# EAGLE design ethernet (EAGLE 4.16)
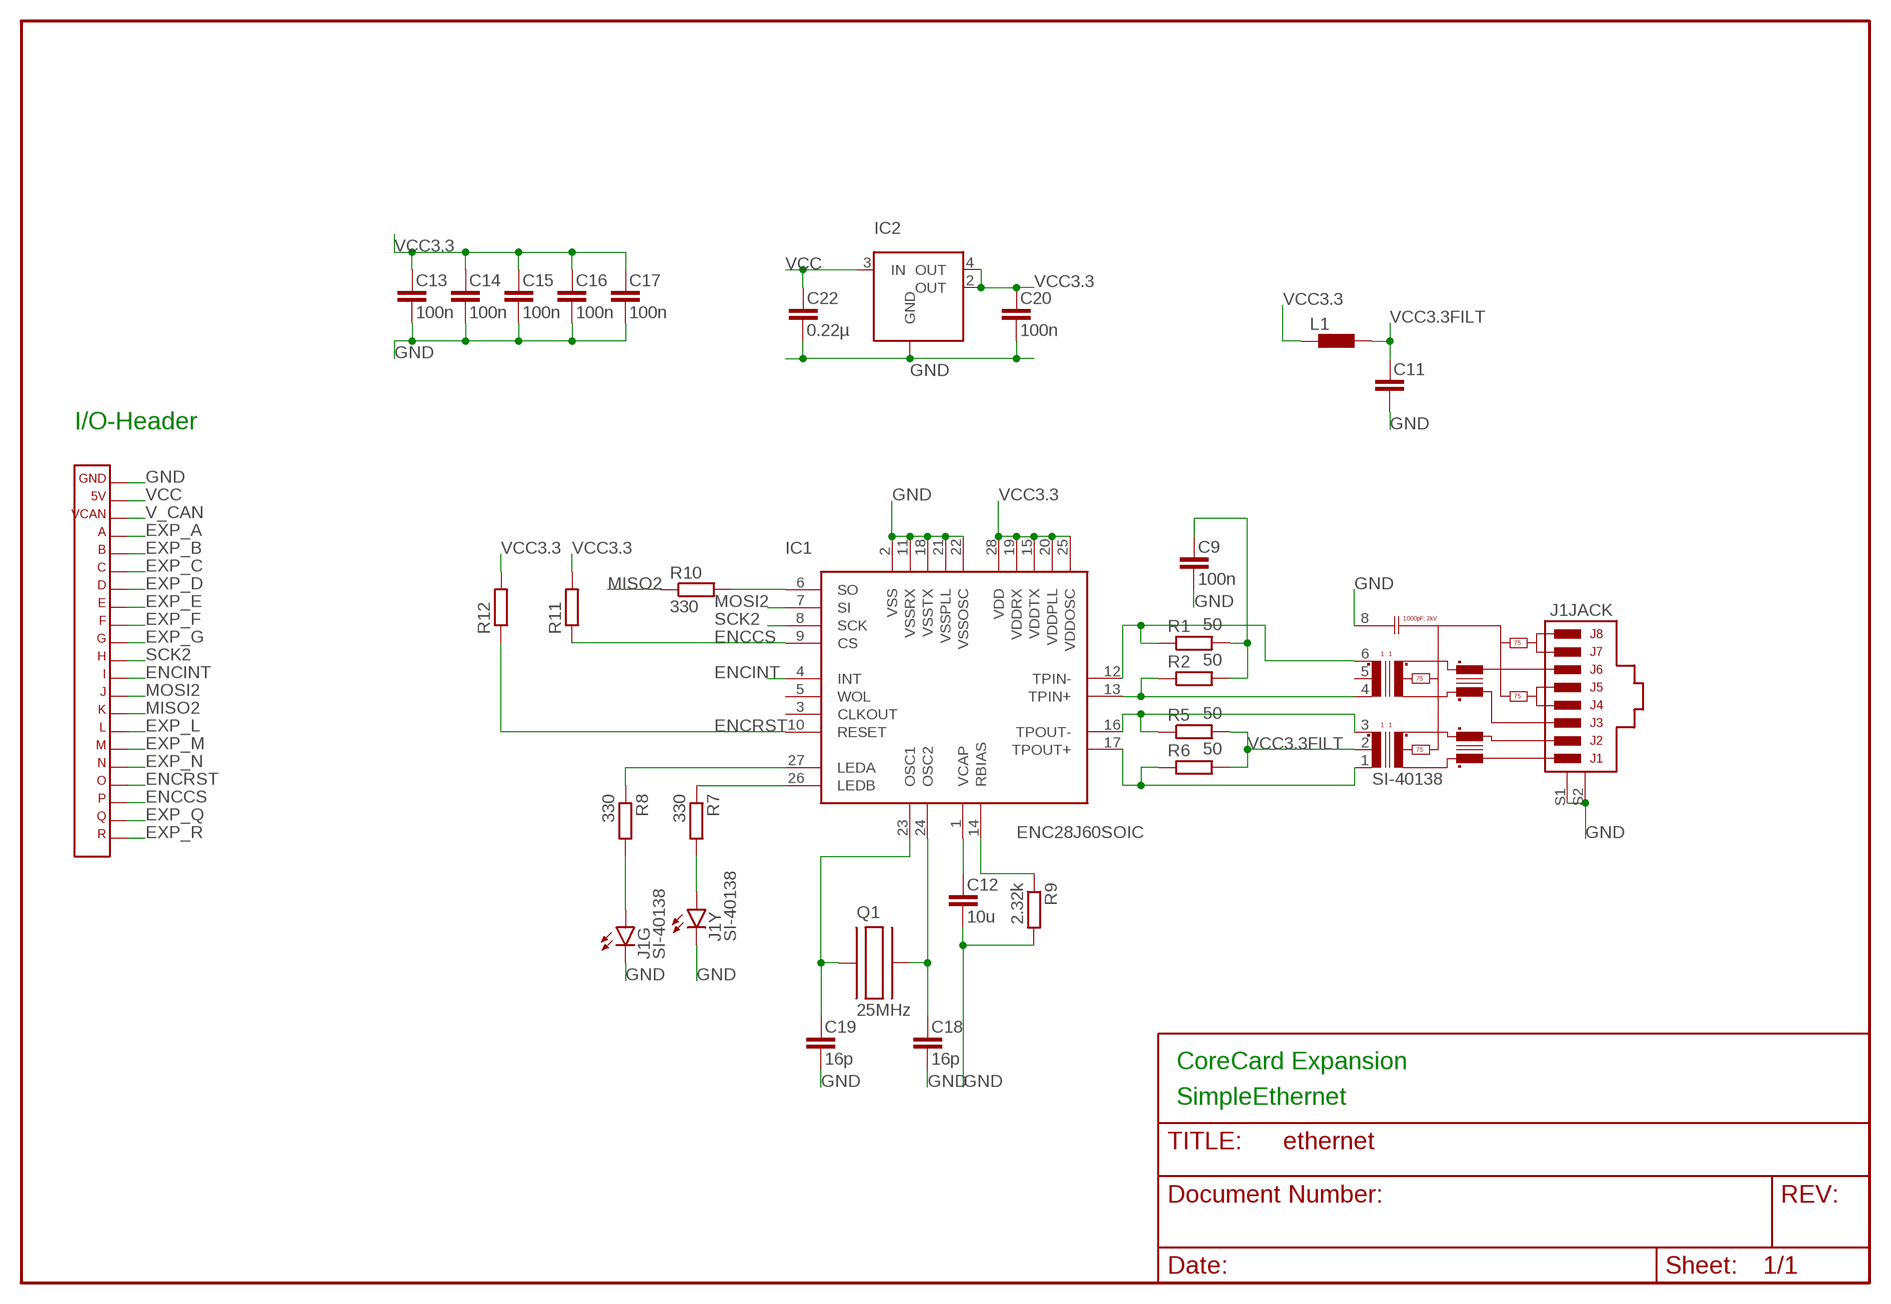
[diagram p0: schematic, sheet 1]

## Parts
C9  100n  C-EUC0603  [C0603]
C11  C-EUC0603  [C0603]
C12  10u  C-EUC0603  [C0603]
C13  100n  C-EUC0603  [C0603]
C14  100n  C-EUC0603  [C0603]
C15  100n  C-EUC0603  [C0603]
C16  100n  C-EUC0603  [C0603]
C17  100n  C-EUC0603  [C0603]
C18  16p  C-EUC0603  [C0603]
C19  16p  C-EUC0603  [C0603]
C20  100n  C-EUC0603  [C0603]
C22  0.22µ  C-EUC0603  [C0603]
IC1  ENC28J60SOIC  [SOIC-28]
IC2  LM1117MP-3.3  [SOT223]
J1  SI-40138  [SI-40138]
L1  L-EUL0603  [L0603]
Q1  25MHz  C-MAC-LFA147E  [SMD]
R1  50  R-EUR0603  [R0603]
R2  50  R-EUR0603  [R0603]
R5  50  R-EUR0603  [R0603]
R6  50  R-EUR0603  [R0603]
R7  330  R-EUR0603  [R0603]
R8  330  R-EUR0603  [R0603]
R9  2.32k  R-EUR0603  [R0603]
R10  330  R-EUR0603  [R0603]
R11  R-EUR0603  [R0603]
R12  R-EUR0603  [R0603]
X3  CORE_IOHEADEXP  [CORE_IOHEAD_NOSILC]

## Nets
ENCCS: IC1.9(CS) R11.1 X3.19
ENCINT: IC1.4(INT) X3.12
ENCRST: IC1.10(RESET) R12.1 X3.18
EXP_A: X3.4
EXP_B: X3.5
EXP_C: X3.6
EXP_D: X3.7
EXP_E: X3.8
EXP_F: X3.9
EXP_G: X3.10
EXP_L: X3.15
EXP_M: X3.16
EXP_N: X3.17
EXP_Q: X3.20
EXP_R: X3.21
GND: C9.2 C11.2 C12.2 C13.2 C14.2 C15.2 C16.2 C18.2 C19.2 C20.2 C22.2 IC1.2(VSS) IC1.11(VSSRX) IC1.18(VSSTX) IC1.21(VSSPLL) IC1.22(VSSOSC) IC2.1(GND) J1.8(JACK:GND) J1.GC(G:C) J1.S1(JACK:S1) J1.S2(JACK:S2) J1.YC(Y:C) R9.2 X3.1
MISO2: R10.1 X3.14
MOSI2: IC1.7(SI) X3.13
N$1: C18.1 IC1.24(OSC2) Q1.P$2
N$2: C19.1 IC1.23(OSC1) Q1.P$1
N$3: IC1.6(SO) R10.2
N$4: C12.1 IC1.1(VCAP)
N$5: IC1.14(RBIAS) R9.1
N$6: IC1.27(LEDA) R8.1
N$7: IC1.26(LEDB) R7.1
N$9: J1.YA(Y:A) R7.2
N$10: J1.GA(G:A) R8.2
N$13: IC1.13(TPIN+) J1.4(JACK:TD-) R2.1
N$14: IC1.16(TPOUT-) J1.3(JACK:RD+) R5.1
N$16: IC1.17(TPOUT+) J1.1(JACK:RD-) R6.1
N$17: C9.1 R1.2 R2.2
N$18: IC1.12(TPIN-) J1.6(JACK:TD+) R1.1
SCK2: IC1.8(SCK) X3.11
V_CAN: X3.3
VCC: C22.1 IC2.3(IN) X3.2
VCC3.3: C13.1 C14.1 C15.1 C16.1 C17.1 C20.1 IC1.15(VDDTX) IC1.19(VDDRX) IC1.20(VDDPLL) IC1.25(VDDOSC) IC1.28(VDD) IC2.2(OUT) IC2.4(OUT) L1.1 R11.2 R12.2
VCC3.3FILT: C11.1 J1.2(JACK:CTR) L1.2 R5.2 R6.2
Unconnected: C17.2 IC1.3(CLKOUT) IC1.5(WOL) J1.5(JACK:CTT)

## Notes on the sheet
- I/O-Header
- CoreCard Expansion
- SimpleEthernet

## Library data of the parts
C9 C11-C20 C22 = rcl:C-EU
IC1 = enc28j60:ENC28J60
IC2 = lm1117mp:LM1117MP-3.3
J1 = stewart_magjack:SI-40138
L1 = rcl:L-EU
Q1 = hc49-4h-smx:C-MAC-LFA147E
R1 R2 R5-R12 = rcl:R-EU
X3 = expboard:CORE_IOHEAD: CoreCard IO-header for expansion cards

## Board
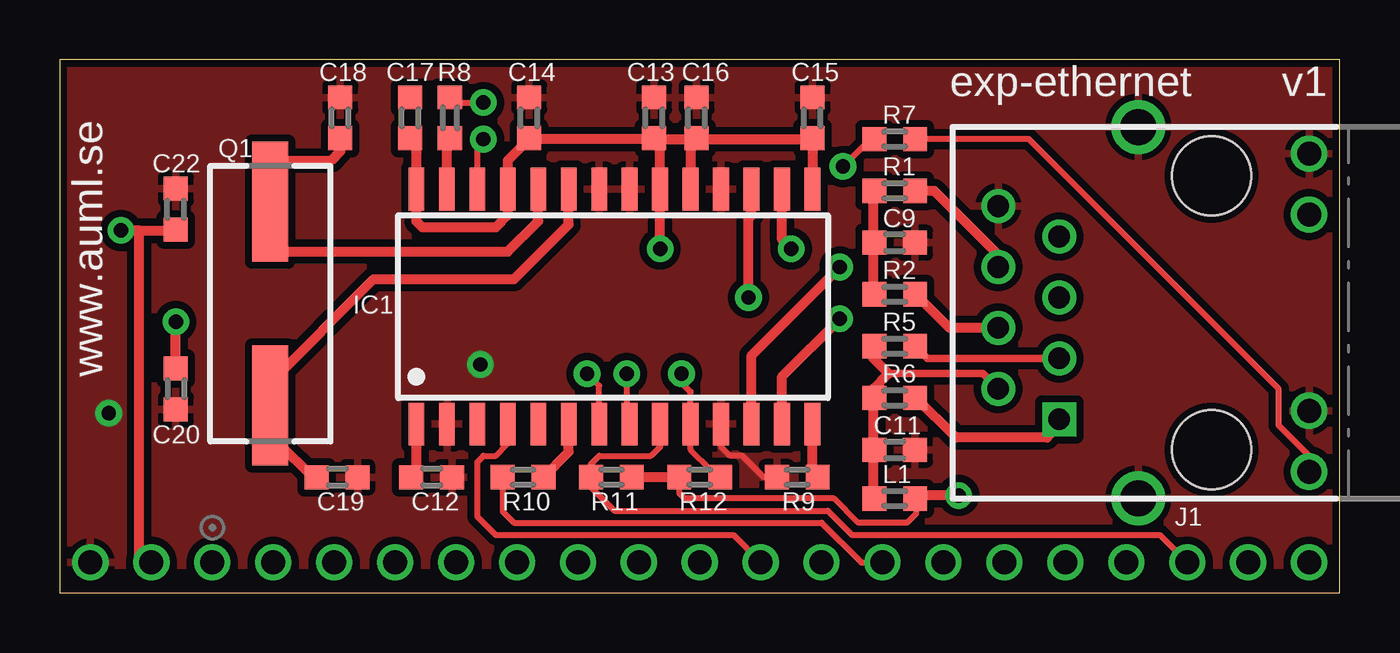
[diagram p1: board, top side]
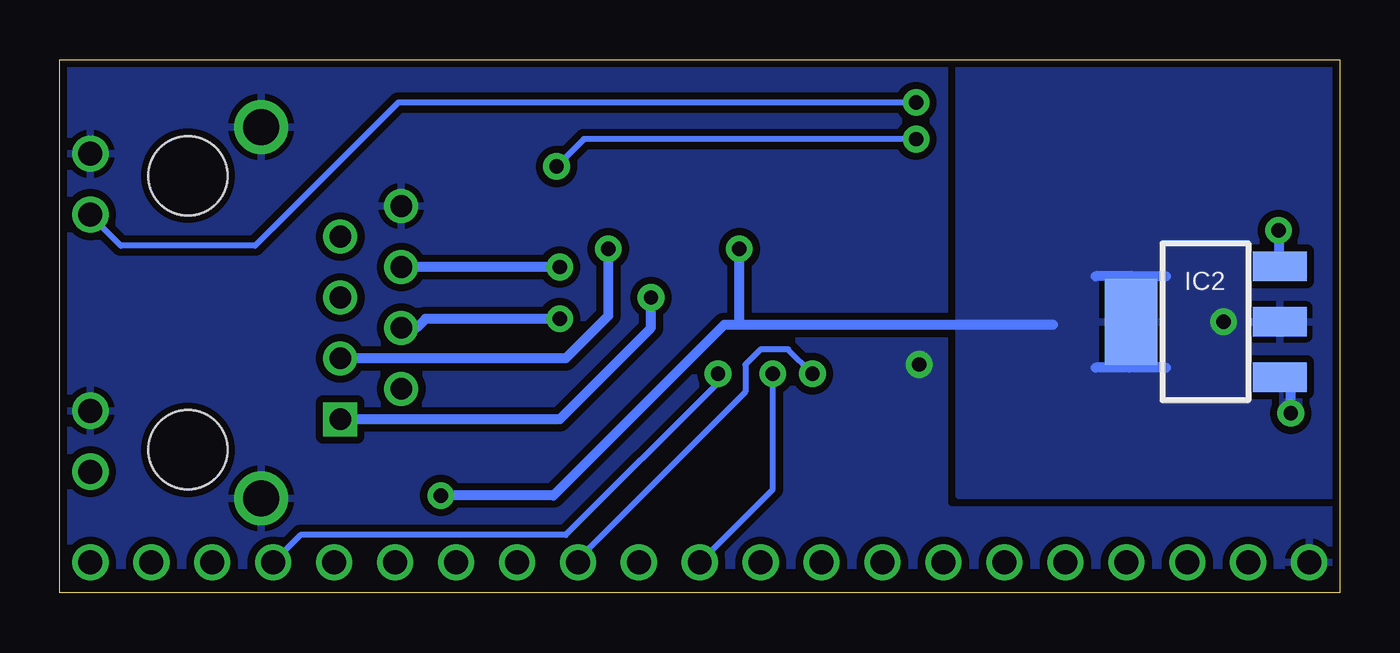
[diagram p2: board, bottom side, seen from below]

Size 53.34 x 22.23 mm. Coordinates in mm from the lower left corner, seen from the top.
Outline: 0,0 53.34,0 53.34,22.23 0,22.23 0,0
Copper layers (1*16): Top 0.035mm / dielectric 1.5mm / Bottom 0.035mm
Design rules "default": minimum track width 10mil, minimum drill 0.4mm, track to track 10mil, track to pad 10mil, pad to pad 10mil, via to via 10mil, smd to smd 8mil, copper to edge 10mil, drill to drill 8mil, minimum pad ring 10mil, minimum via ring 10mil, stop-mask expansion 4mil, vias tented up to drill 18mil, thermal gap 10mil

### Footprints (pad centres in the part's own frame; a part is rotated, then mirrored left to right if it is on the bottom)
C0603 = smd 1 x 1: 1 -0.85,0; 2 0.85,0
SOIC-28 = smd 0.66 x 1.778: 1 -6.985,-4.902; 2 -5.715,-4.902; 3 -4.445,-4.902; 4 -3.175,-4.902; 5 -1.905,-4.902; 6 -0.635,-4.902; 7 0.635,-4.902; 8 1.905,-4.902; 9 3.175,-4.902; 10 4.445,-4.902; 11 5.715,-4.902; 12 6.985,-4.902; 13 8.255,-4.902; 14 9.525,-4.902; 15 9.525,4.902; 16 8.255,4.902; 17 6.985,4.902; 18 5.715,4.902; 19 4.445,4.902; 20 3.175,4.902; 21 1.905,4.902; 22 0.635,4.902; 23 -0.635,4.902; 24 -1.905,4.902; 25 -3.175,4.902; 26 -4.445,4.902; 27 -5.715,4.902; 28 -6.985,4.902
SOT223 = smd 1.219 x 2.235: 1 -2.311,-3.099; 2 0,-3.099; 3 2.311,-3.099 | smd 3.6 x 2.2: 4 0,3.099
SI-40138 = drill 0.9 square: 1 -4.445,6.35 | drill 0.9 round: 2 -3.175,8.89; 3 -1.905,6.35; 4 -0.635,8.89; 5 0.635,6.35; 6 1.905,8.89; 7 3.175,6.35; 8 4.445,8.89 | drill 1 round: GA 4.089,-4.064; GC 6.629,-4.064; YA -6.629,-4.064; YC -4.089,-4.064 | drill 1.5 round: S1 -7.747,3.048; S2 7.747,3.048 | hole 3.3: -5.715,0; 5.715,0
L0603 = smd 0.991 x 1.016: 1 -0.85,0; 2 0.85,0
SMD = smd 5 x 1.5: P$1 4.25,0; P$2 -4.25,0
R0603 = smd 0.991 x 1.016: 1 -0.85,0; 2 0.85,0
CORE_IOHEAD_NOSILC = drill 1 round: 1 25.4,0; 2 22.86,0; 3 20.32,0; 4 17.78,0; 5 15.24,0; 6 12.7,0; 7 10.16,0; 8 7.62,0; 9 5.08,0; 10 2.54,0; 11 0,0; 12 -2.54,0; 13 -5.08,0; 14 -7.62,0; 15 -10.16,0; 16 -12.7,0; 17 -15.24,0; 18 -17.78,0; 19 -20.32,0; 20 -22.86,0; 21 -25.4,0

### Placement (x,y rotation side)
C9  34.8,14.61 0 top
C11  34.8,5.97 0 top
C12  15.49,4.83 0 top
C13  24.77,19.81 90 top
C14  19.56,19.81 90 top
C15  31.37,19.81 90 top
C16  26.54,19.81 90 top
C17  14.61,19.81 90 top
C18  11.68,19.81 90 top
C19  11.56,4.83 0 top
C20  4.83,8.51 270 top
C22  4.83,16 90 top
IC1  21.84,11.94 0 top
IC2  5.59,11.3 90 bottom
J1  48.01,11.68 90 top
L1  34.8,3.94 180 top
Q1  8.76,12.06 270 top
R1  34.8,16.76 180 top
R2  34.8,12.45 180 top
R5  34.8,10.29 180 top
R6  34.8,8.13 180 top
R7  34.8,18.92 0 top
R8  16.26,19.81 90 top
R9  30.73,4.83 180 top
R10  19.3,4.83 0 top
R11  22.99,4.83 0 top
R12  26.67,4.83 180 top
X3  26.67,1.27 0 bottom

### Tracks (layer width: path | path; a pad name or v marks a point on that pad's centre or on a via)
ENCCS
  Top 0.254: IC1.9 25.02,6.1 24.64,5.71 22.48,5.71 22.14,5.37 R11.1 22.1,4.83 22.1,4.45 23.11,3.43 32,3.43 33.02,2.41 45.85,2.41 X3.19
ENCINT
  Top 0.254: IC1.4 18.67,6.22 18.16,5.71 17.65,5.71 17.4,5.46 17.4,3.17 18.16,2.41 28.07,2.41 X3.12
ENCRST  (via drill 0.6)
  Top 0.254: R12.1 27.14,5.12 26.29,5.97 26.29,6.99 | 26.29,6.99 IC1.10 | 26.29,6.99 26.29,8.38 25.91,8.76 v25.91,9.14
  Bottom 0.254: X3.18 43.31,2.41 32.26,2.41 25.91,8.76 v25.91,9.14
GND  (via drill 0.6)
  Top 0.254: R9.2 29.34,4.83 28.45,5.71 27.94,5.71 27.56,6.1 IC1.11
  Top 0.406: v2.03,7.49 2.16,7.62
  Bottom 0.406: IC2.1 2.03,8.99 v2.03,7.49
  other vias: 17.53,9.53
  pour Bottom (isolate 0.305, rank 3): 0,22.23 53.34,22.23 53.34,1.14 0,1.14
  pour Top (isolate 0.305, rank 3): 0,22.23 53.34,22.23 53.34,1.14 0,1.14
MISO2
  Top 0.254: R10.1 18.45,3.39 18.92,2.92 31.75,2.92 33.4,1.27 X3.14
MOSI2  (via drill 0.6)
  Top 0.254: IC1.7 22.48,8.64 v21.97,9.14
  Bottom 0.254: v21.97,9.14 22.99,10.16 24.13,10.16 24.77,9.53 24.77,8.38 31.75,1.4 X3.13
N$1
  Top 0.406: IC1.24 19.94,15.49 18.67,14.22 8.76,14.22 Q1.P$2 8.76,17.53 9.27,18.03 11.3,18.03 11.68,18.41 C18.1
N$2
  Top 0.406: IC1.23 21.21,15.37 18.92,13.08 13.08,13.08 8.76,8.76 Q1.P$1 9.27,6.1 10.41,4.95 C19.1
N$3
  Top 0.406: R10.2 21.21,5.88 IC1.6
N$4
  Top 0.406: C12.1 14.86,5.04 IC1.1
N$5
  Top 0.406: R9.1 31.37,5.04 IC1.14
N$6
  Top 0.406: R8.1 16.26,18.92 16.13,18.8 IC1.27
N$7  (via drill 0.6)
  Top 0.254: IC1.26 17.4,18.67 v17.65,18.92 | v32.64,17.78 33.78,18.92 R7.1
  Bottom 0.254: v17.65,18.92 31.5,18.92 v32.64,17.78
N$9
  Top 0.254: J1.YA 52.07,5.71 50.8,6.99 50.8,8.51 40.39,18.92 R7.2
N$10  (via drill 0.6)
  Top 0.254: R8.2 16.26,20.45 v17.65,20.45
  Bottom 0.254: v17.65,20.45 39.24,20.45 45.21,14.48 50.8,14.48 52.07,15.75 J1.GA
N$13  (via drill 0.6)
  Top 0.406: J1.4 37.08,11.05 35.69,12.45 R2.1 | IC1.13 30.1,9.02 v32.51,11.43
  Bottom 0.406: J1.4 38.48,11.05 38.1,11.43 v32.51,11.43
N$14  (via drill 0.6)
  Top 0.305: R5.1 36.16,9.78 J1.3
  Top 0.406: v30.48,14.35 30.1,14.73 IC1.16
  Bottom 0.406: v30.48,14.35 30.48,11.56 32.26,9.78 J1.3
N$16  (via drill 0.6)
  Top 0.406: R6.1 35.69,8.13 37.34,6.48 41.15,6.48 41.66,6.99 J1.1 | v28.7,12.32 28.7,15.75 28.83,15.75 IC1.17
  Bottom 0.406: J1.1 32.51,7.24 28.7,11.05 v28.7,12.32
N$17
  Top 0.406: R1.2 33.91,16.73 33.91,14.61 | 33.91,14.61 C9.1 33.91,14.95 33.91,14.61 | R2.2 33.91,12.74 33.91,14.61
N$18  (via drill 0.6)
  Top 0.406: 35.56,16.76 R1.1 36.45,16.76 39.12,14.1 J1.6 | IC1.12 28.83,9.91 v32.51,13.59
  Bottom 0.406: v32.51,13.59 J1.6
SCK2  (via drill 0.6)
  Top 0.254: v23.62,9.14 23.62,7.24 IC1.8
  Bottom 0.254: v23.62,9.14 23.62,4.32 X3.11
VCC  (via drill 0.6)
  Top 0.406: 3.3,15.11 v2.54,15.11 | 3.3,15.11 4.7,15.11 C22.1 | X3.2 3.3,1.27 3.3,15.11
  Bottom 0.406: 2.54,13.61 2.54,13.59 | 2.54,13.61 IC2.3 | v2.54,15.11 2.54,13.61
VCC3.3  (via drill 0.6)
  Top 0.254: R12.2 25.82,4.15 26.04,3.94 32.26,3.94 33.27,2.92 35.31,2.92 35.69,3.3 35.69,3.81
  Top 0.406: 19.56,18.92 18.67,18.03 IC1.25 18.67,15.75 18.16,15.24 15.11,15.24 14.86,15.49 IC1.28 14.86,18.67 14.57,18.96 C17.1 | 25.02,16.89 25.02,18.8 24.89,18.92 | 25.02,16.89 IC1.20 | 26.54,18.92 26.29,18.67 26.29,16.89 26.36,16.84 IC1.19 | 31.37,18.92 IC1.15 | 19.56,18.92 C14.1 | 24.89,18.92 24.85,18.96 C13.1 | 24.89,18.92 19.56,18.92 | 24.89,18.92 26.54,18.92 | 26.54,18.92 C16.1 | 31.37,18.92 C15.1 | 26.54,18.92 31.37,18.92 | R12.2 R11.2 | 35.69,3.81 35.65,3.85 L1.1 35.65,4.03 35.69,4.06 v37.47,4.06 | v25.02,14.35 25.02,16.89 | C20.1 v4.83,11.3
  Bottom 0.406: 25.02,11.18 v25.02,14.35 | 11.94,11.18 25.02,11.18 | 25.02,11.18 25.65,11.18 32.77,4.06 v37.47,4.06 | v4.83,11.3 4.7,11.3 | 8.64,13.21 7.24,13.21 | 8.64,13.21 10.16,13.21 | 7.24,9.4 8.76,9.4 | 8.76,9.4 10.16,9.4 | 8.64,13.21 8.64,11.43 8.69,11.38 IC2.4 8.76,11.3 8.76,9.4
  pour Bottom (isolate 0.305): 0,22.23 15.88,22.23 15.88,4.06 0,4.06
VCC3.3FILT
  Top 0.305: J1.2 38.48,9.14 34.54,9.14
  Top 0.406: R5.2 33.91,10.38 33.91,9.78 34.54,9.14 33.91,8.51 33.91,8.17 R6.2 33.91,8.13 33.91,5.97 | L1.2 33.95,3.9 33.91,3.94 33.91,5.97 | 33.91,5.97 C11.1

### Text on the board
tPlace: exp-ethernet | v1 | www.auml.se
Document: Top is component side | Expansion will be mounted bottom to bottom with CoreCard | Change vertical dimension to fit | Remove I/O-header silcscreen if neccesary | Remove mounting holes if neccesary
tDocu: - | + | A | B | C | D | E | F | G | H | I | J | K | L | M | N | O | P | Q | R